# Altium schematic sheet USB_TypeC.SchDoc
size A4; SheetNumber: 17; SheetTotal: 20
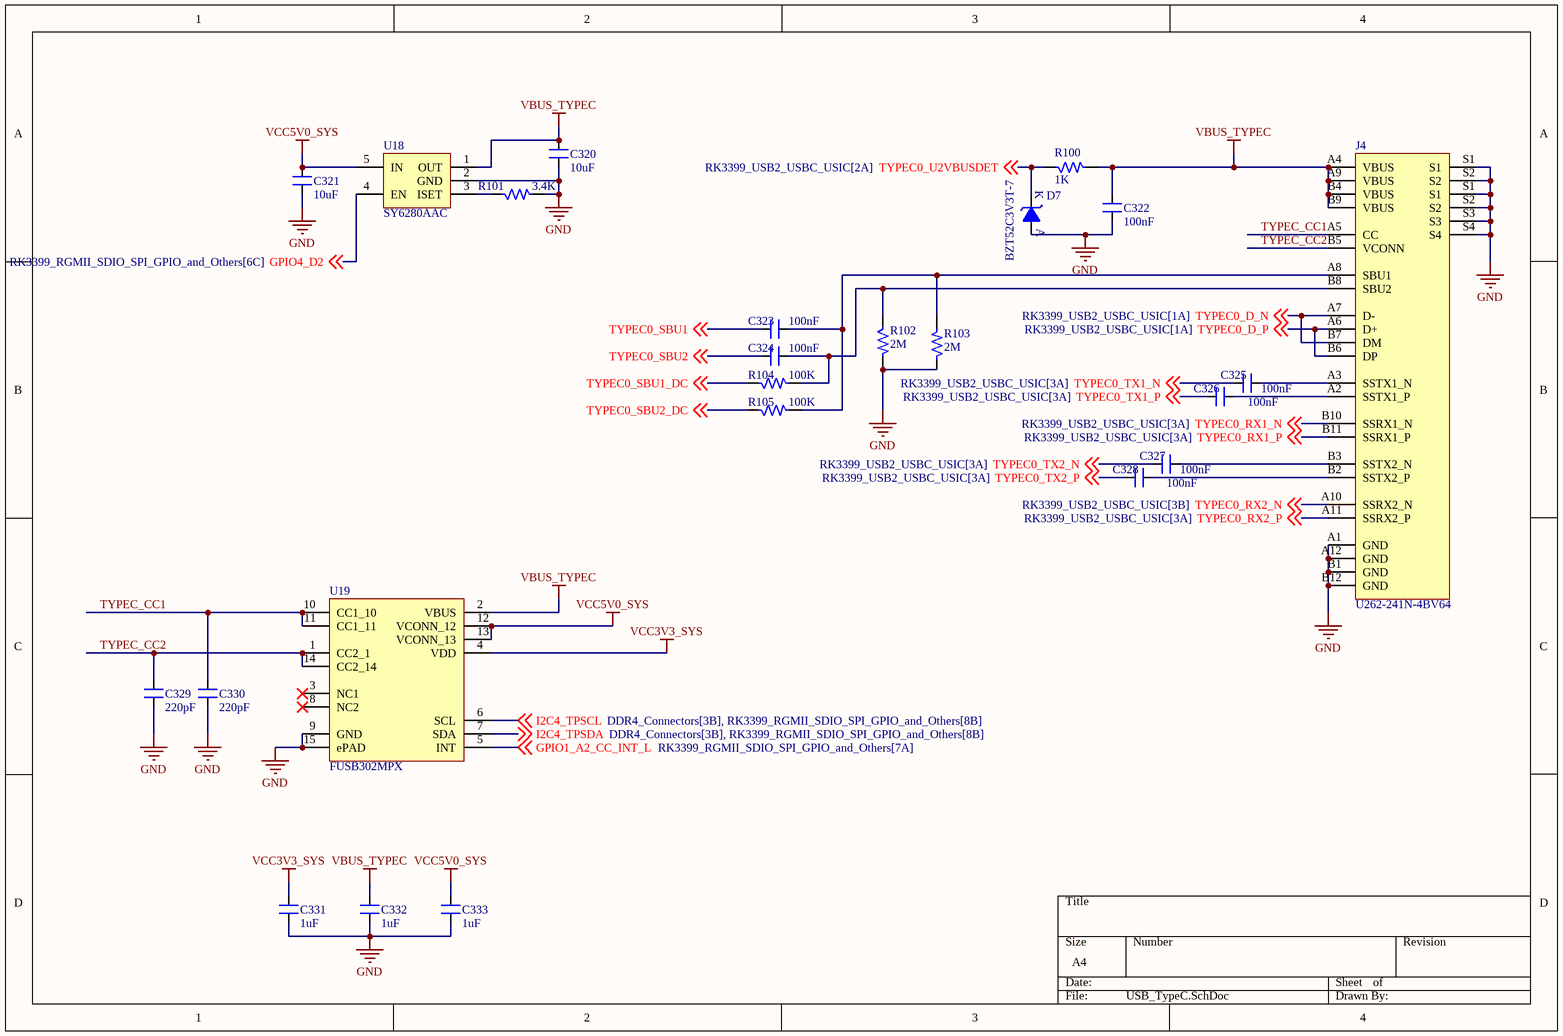
[diagram p0: USB_TypeC.SchDoc]

## Parts
C320  10uF  [CAP_0402]
C321  10uF  [CAP_0402]
C322  100nF  [CAP_0603]
C323  100nF  [CAP_0603]
C324  100nF  [CAP_0603]
C325  100nF  [CAP_0603]
C326  100nF  [CAP_0603]
C327  100nF  [CAP_0603]
C328  100nF  [CAP_0603]
C329  220pF  [CAP_0402]
C330  220pF  [CAP_0402]
C331  1uF  [CAP_0402]
C332  1uF  [CAP_0402]
C333  1uF  [CAP_0402]
D7  BZT52C3V3T-7  [DIO_SOD523]
J4  U262-241N-4BV64  [CON24_19.64_U262-241N-4BV64_TH_RA]
R100  1K  [RES_0402]
R101  3.4K  [RES_0402]
R102  2M  [RES_0402]
R103  2M  [RES_0402]
R104  100K  [RES_0402]
R105  100K  [RES_0402]
U18  SY6280AAC  [SOT23-5]
U19  FUSB302MPX  [MLP-14_98.4X98.4_SMD]

## Nets
GND: C320.1 C321.1 C322.1 C329.1 C330.1 C331.1 C332.1 C333.1 D7.A J4.A1(GND) J4.A12(GND) J4.B1(GND) J4.B12(GND) J4.S1 J4.S2 J4.S3 J4.S4 R101.2 R102.2 R103.1 U18.2(GND) U19.9(GND) U19.15(ePAD)
VBUS_TYPEC: C320.2 C322.2 C332.2 J4.A4(VBUS) J4.A9(VBUS) J4.B4(VBUS) J4.B9(VBUS) R100.2 U18.1(OUT) U19.2(VBUS)
VCC3V3_SYS: C331.2 U19.4(VDD)
VCC5V0_SYS: C321.2 C333.2 U18.5(IN) U19.12(VCONN_12) U19.13(VCONN_13)
GPIO1_A2_CC_INT_L: U19.5(INT) ; off-sheet GPIO1_A2_CC_INT_L
GPIO4_D2: U18.4(EN) ; off-sheet GPIO4_D2
I2C4_TPSCL: U19.6(SCL) ; off-sheet I2C4_TPSCL
I2C4_TPSDA: U19.7(SDA) ; off-sheet I2C4_TPSDA
TYPEC0_D_N: J4.A7(D-) J4.B7(DM) ; off-sheet TYPEC0_D_N
TYPEC0_D_P: J4.A6(D+) J4.B6(DP) ; off-sheet TYPEC0_D_P
TYPEC0_RX1_N: J4.B10(SSRX1_N) ; off-sheet TYPEC0_RX1_N
TYPEC0_RX1_P: J4.B11(SSRX1_P) ; off-sheet TYPEC0_RX1_P
TYPEC0_RX2_N: J4.A10(SSRX2_N) ; off-sheet TYPEC0_RX2_N
TYPEC0_RX2_P: J4.A11(SSRX2_P) ; off-sheet TYPEC0_RX2_P
TYPEC0_SBU1: C323.2 ; off-sheet TYPEC0_SBU1
TYPEC0_SBU1_DC: R104.1 ; off-sheet TYPEC0_SBU1_DC
TYPEC0_SBU2: C324.2 ; off-sheet TYPEC0_SBU2
TYPEC0_SBU2_DC: R105.1 ; off-sheet TYPEC0_SBU2_DC
TYPEC0_TX1_N: C325.2 ; off-sheet TYPEC0_TX1_N
TYPEC0_TX1_P: C326.2 ; off-sheet TYPEC0_TX1_P
TYPEC0_TX2_N: C327.2 ; off-sheet TYPEC0_TX2_N
TYPEC0_TX2_P: C328.2 ; off-sheet TYPEC0_TX2_P
TYPEC0_U2VBUSDET: D7.K R100.1 ; off-sheet TYPEC0_U2VBUSDET
TYPEC_CC1: C330.2 J4.A5(CC) U19.10(CC1_10) U19.11(CC1_11)
TYPEC_CC2: C329.2 J4.B5(VCONN) U19.1(CC2_1) U19.14(CC2_14)
NetC323_1: C323.1 J4.A8(SBU1) R103.2 R105.2
NetC324_1: C324.1 J4.B8(SBU2) R102.1 R104.2
NetC325_1: C325.1 J4.A3(SSTX1_N)
NetC326_1: C326.1 J4.A2(SSTX1_P)
NetC327_1: C327.1 J4.B3(SSTX2_N)
NetC328_1: C328.1 J4.B2(SSTX2_P)
NetR101_1: R101.1 U18.3(ISET)

Not connected (* = marked no-connect by the designer): U19 3(NC1)* 8(NC2)*

## Library data of the parts
C320 C321 = CAP_10uF-10V-20%-0402: 10µF ±20% 10V Ceramic Capacitor X5R 0402 (1005 Metric); Manufacturer Part Number: CL05A106MP5NUNC; Manufacturer: Samsung Electro-Mechanics; Case/Package: 0402; Supplier-1: Digikey
C322-C328 = CAP_100nF-10V-5%-0603: 0.1µF ±10% 10V Ceramic Capacitor X7R 0603 (1608 Metric); Manufacturer: Yageo; Manufacturer Part Number: CC0603KRX7R6BB104; Case/Package: 0603; Supplier-1: Digikey
C329 C330 = CAP_220pF-10V-10%-0402: 220pF ±10% 10V Ceramic Capacitor X7R 0402 (1005 Metric); Manufacturer: KEMET; Manufacturer Part Number: C0402C221K8RAC7867; Case/Package: 0402; Supplier-1: Digikey
C331-C333 = CAP_1uF-10V-10%-0402: 1µF ±10% 10V Ceramic Capacitor X6S 0402 (1005 Metric); Manufacturer: Murata Electronics; Manufacturer Part Number: GRT155C81A105KE01D; Case/Package: 0402; Supplier-1: Digikey
D7 = DIO-Z_3.3V-300mW-SOD-523: Zener Diode 3.3V 300mW ±6% Surface Mount SOD-523; Manufacturer: Diodes Incorporated; Manufacturer Part Number: BZT52C3V3T-7; Case/Package: SOD523; Supplier-1: Digikey
J4 = CON-TYPEC_U262-241N-4BV64-SMD: USB - Type C Female 24 SMD USB Connectors RoHS; Manufacturer: XKB Connectivity; Manufacturer Part Number: U262-241N-4BV64; Case/Package: SMD; Supplier-1: LCSC
R100 = RES_1K-0.1W-1%-0402: 1 kOhms ±1% 0.1W, 1/10W Chip Resistor 0402 (1005 Metric) Anti-Sulfur Thin Film; Manufacturer: Vishay Beyschlag/Draloric/BC Components; Manufacturer Part Number: MCS04020C1001FE000; Case/Package: 0402; Supplier-1: Digikey
R101 = RES_3.4K-0.1W-1%-0402: 3.4 kOhms ±1% 0.1W, 1/10W Chip Resistor 0402 (1005 Metric) Automotive AEC-Q200 Thick Film; Manufacturer: Panasonic Electronic Components; Manufacturer Part Number: ERJ-2RKF3401X; Case/Package: 0402; Supplier-1: Digikey
R102 R103 = RES_2M-0.1W-1%-0402: 2 MOhms ±1% 0.1W, 1/10W Chip Resistor 0402 (1005 Metric) Anti-Sulfur Thin Film; Manufacturer: Vishay Beyschlag/Draloric/BC Components; Manufacturer Part Number: MCS04020C2004FE000; Case/Package: 0402; Supplier-1: Digikey
R104 R105 = RES_100K-0.1W-1%-0402: 100 kOhms ±1% 0.1W, 1/10W Chip Resistor 0402 (1005 Metric) Anti-Sulfur Thin Film; Manufacturer: Vishay Beyschlag/Draloric/BC Components; Manufacturer Part Number: MCS04020C1003FE000; Case/Package: 0402; Supplier-1: Digikey
U18 = REG-ADJ_5.5V-5.5V-1.25A-SOT-23-5: SOT-23-5 PMIC - Power Distribution Switches RoHS; Manufacturer: Silergy Corp; Manufacturer Part Number: SY6280AAC; Case/Package: SOT-23-5; Supplier-1: LCSC
U19 = IC_FUSB302MPX: USB Controller USB 3.1 USB Interface 14-MLP (2.5x2.5); Manufacturer: ON Semiconductor; Manufacturer Part Number: FUSB302MPX; Case/Package: 14-MLP; Supplier-1: Digikey